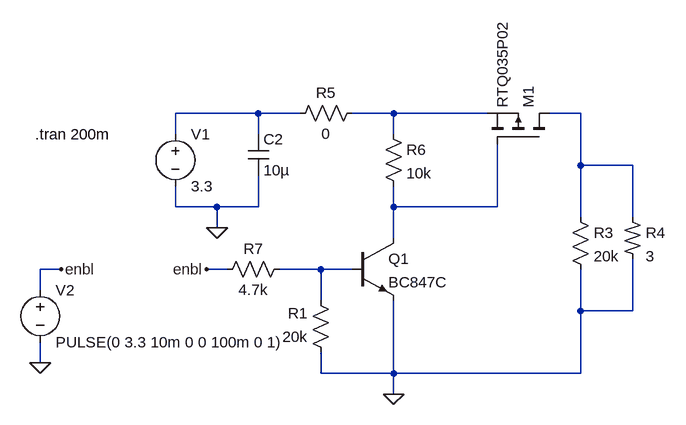
[diagram p0: schematic supply_switch.asc]
supply_switch.asc, the LTspice schematic file:
Version 4
SHEET 1 1484 680
WIRE 656 -560 528 -560
WIRE 720 -560 656 -560
WIRE 864 -560 800 -560
WIRE 1008 -560 864 -560
WIRE 1152 -560 1104 -560
WIRE 528 -528 528 -560
WIRE 656 -528 656 -560
WIRE 864 -528 864 -560
WIRE 1152 -480 1152 -560
WIRE 1232 -480 1152 -480
WIRE 528 -416 528 -448
WIRE 592 -416 528 -416
WIRE 656 -416 656 -464
WIRE 656 -416 592 -416
WIRE 864 -416 864 -448
WIRE 1024 -416 1024 -512
WIRE 1024 -416 864 -416
WIRE 1152 -400 1152 -480
WIRE 1232 -400 1232 -480
WIRE 592 -384 592 -416
WIRE 864 -368 864 -416
WIRE 352 -320 320 -320
WIRE 608 -320 576 -320
WIRE 752 -320 688 -320
WIRE 800 -320 752 -320
WIRE 320 -288 320 -320
WIRE 752 -272 752 -320
WIRE 1152 -256 1152 -320
WIRE 1232 -256 1232 -336
WIRE 1232 -256 1152 -256
WIRE 320 -176 320 -208
WIRE 752 -160 752 -192
WIRE 864 -160 864 -272
WIRE 864 -160 752 -160
WIRE 1152 -160 1152 -256
WIRE 1152 -160 864 -160
WIRE 864 -128 864 -160
FLAG 576 -320 enbl
FLAG 320 -176 0
FLAG 352 -320 enbl
FLAG 592 -384 0
FLAG 864 -128 0
SYMBOL cap 640 -528 R0
SYMATTR InstName C2
SYMATTR Value 10µ
SYMBOL res 768 -176 R180
WINDOW 0 36 76 Left 2
WINDOW 3 36 40 Left 2
SYMATTR InstName R1
SYMATTR Value 20k
SYMBOL res2 1216 -400 R0
SYMATTR InstName R4
SYMATTR Value 3
SYMBOL voltage 528 -544 R0
WINDOW 123 0 0 Left 2
WINDOW 39 0 0 Left 2
SYMATTR InstName V1
SYMATTR Value 3.3
SYMBOL voltage 320 -304 R0
WINDOW 123 0 0 Left 2
WINDOW 39 0 0 Left 2
SYMATTR InstName V2
SYMATTR Value PULSE(0 3.3 10m 0 0 100m 0 1)
SYMBOL res 816 -576 R90
WINDOW 0 0 56 VBottom 2
WINDOW 3 32 56 VTop 2
SYMATTR InstName R5
SYMATTR Value 0
SYMBOL res 1136 -416 R0
SYMATTR InstName R3
SYMATTR Value 20k
SYMBOL pmos 1104 -512 M270
SYMATTR InstName M1
SYMATTR Value RTQ035P02
SYMBOL npn 800 -368 R0
SYMATTR InstName Q1
SYMATTR Value BC847C
SYMBOL res 848 -544 R0
SYMATTR InstName R6
SYMATTR Value 10k
SYMBOL res 704 -336 R90
WINDOW 0 0 56 VBottom 2
WINDOW 3 32 56 VTop 2
SYMATTR InstName R7
SYMATTR Value 4.7k
TEXT 312 -528 Left 2 !.tran 200m

The netlist it stands for:
* supply_switch.asc
C2 N001 0 10µ
R1 0 N005 20k
R4 N003 0 3
V1 N001 0 3.3
V2 enbl 0 PULSE(0 3.3 10m 0 0 100m 0 1)
R5 N002 N001 0
R3 N003 0 20k
M1 N003 N004 N002 N002 RTQ035P02
Q1 N004 N005 0 0 BC847C
R6 N002 N004 10k
R7 N005 enbl 4.7k
.model NPN NPN
.model PNP PNP
.lib standard.bjt
.model NMOS NMOS
.model PMOS PMOS
.lib standard.mos
.tran 200m
.backanno
.end